# EAGLE design invader_asyn_bridge (EAGLE 7.5.0)
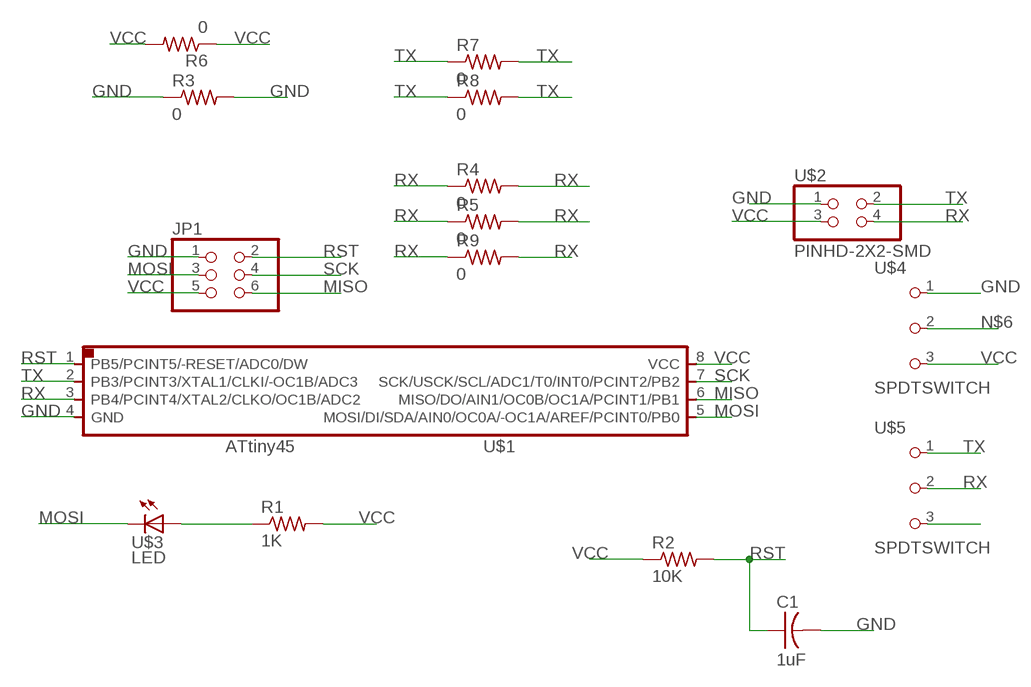
[diagram p0: schematic, sheet 1]

## Parts
C1  1uF  CAP-US1206FAB  [C1206FAB]
JP1  PINHD-2X3-SMD  [2X03SMD]
R1  1K  RES-US1206  [R1206]
R2  10K  RES-US1206  [R1206]
R3  0  RES-US1206  [R1206]
R4  0  RES-US1206  [R1206]
R5  0  RES-US1206  [R1206]
R6  0  RES-US1206  [R1206]
R7  0  RES-US1206  [R1206]
R8  0  RES-US1206  [R1206]
R9  0  RES-US1206  [R1206]
U$1  ATTINY45SI  [SOIC8]
U$2  PINHD-2X2-SMD  [2X02SMD]
U$3  LED  LEDFAB1206  [LED1206FAB]
U$4  SPDTSWITCH  [SPDTSWITCH]
U$5  SPDTSWITCH  [SPDTSWITCH]

## Nets
GND: C1.2 JP1.1 R3.1 R3.2 U$1.4(GND) U$2.1 U$4.1
MISO: JP1.6 U$1.6(MISO/DO/AIN1/OC0B/OC1A/PCINT1/PB1)
MOSI: JP1.3 U$1.5(MOSI/DI/SDA/AIN0/OC0A/-OC1A/AREF/PCINT0/PB0) U$3.2(C)
N$1: R1.1 U$3.1(A)
N$2: U$5.3
N$6: U$4.2
RST: C1.1 JP1.2 R2.2 U$1.1(PB5/PCINT5/-RESET/ADC0/DW)
RX: R4.1 R4.2 R5.1 R5.2 R9.1 R9.2 U$1.3(PB4/PCINT4/XTAL2/CLKO/OC1B/ADC2) U$2.4 U$5.2
SCK: JP1.4 U$1.7(SCK/USCK/SCL/ADC1/T0/INT0/PCINT2/PB2)
TX: R7.1 R7.2 R8.1 R8.2 U$1.2(PB3/PCINT3/XTAL1/CLKI/-OC1B/ADC3) U$2.2 U$5.1
VCC: JP1.5 R1.2 R2.1 R6.1 R6.2 U$1.8(VCC) U$2.3 U$4.3

## Library data of the parts
C1 = fab (1):CAP-US
JP1 = fab (1):PINHD-2X3-SMD: PIN HEADER
R1-R9 = fab (1):RES-US: Resistor (US Symbol) Variants with postfix FAB are widened to allow the routing of internal traces
U$1 = fab (1):ATTINY45
U$2 = fab (1):PINHD-2X2-SMD
U$3 = fab (1):LED: LED
U$4 U$5 = fab:SPDTSWITCH

## Board
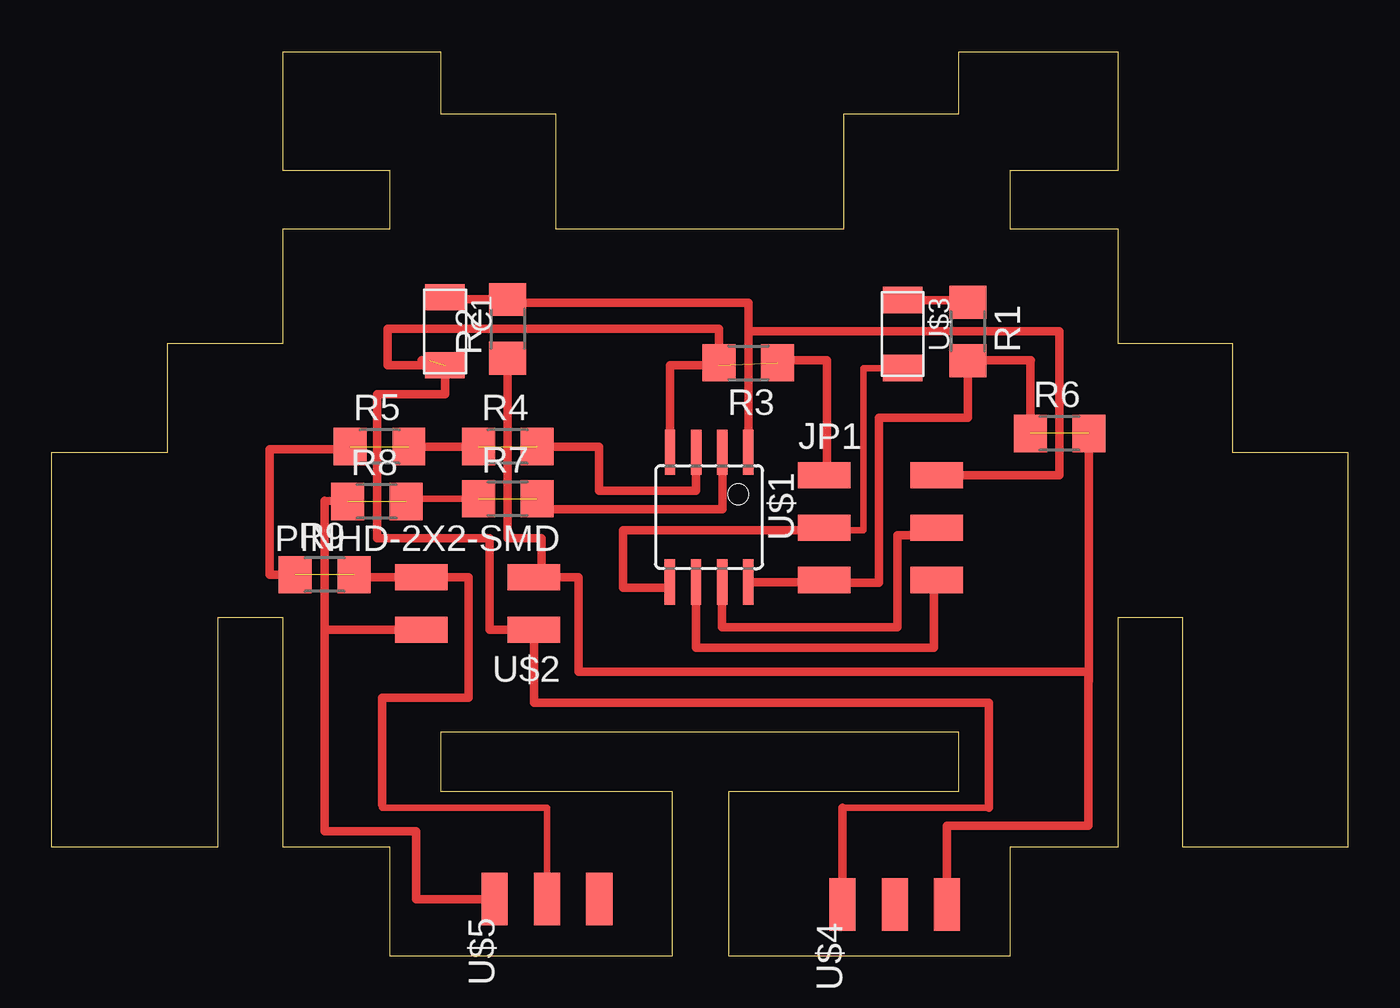
[diagram p1: board, top side]

Size 62.96 x 43.91 mm. Coordinates in mm from the lower left corner, seen from the top.
Outline: 16.45,5.27 11.24,5.27 11.24,16.41 8.06,16.41 8.06,5.27 0,5.27 0,24.45 5.65,24.45 5.65,29.75 11.24,29.75 11.24,35.31 16.45,35.31 16.45,38.13 11.24,38.13 11.24,43.91 18.89,43.91 18.89,40.89 24.48,40.89 24.48,35.31 38.48,35.31 38.48,40.89 44.07,40.89 44.07,43.91 51.78,43.91 51.78,38.13 46.55,38.13 46.55,35.31 51.78,35.31 51.78,29.75 57.34,29.75 57.34,24.45 62.96,24.45 62.96,5.27 54.93,5.27 54.93,16.41 51.78,16.41 51.78,5.27 46.55,5.27 46.55,0 32.89,0 32.89,8 44.07,8 44.07,10.86 18.89,10.86 18.89,8 30.13,8 30.13,0 16.45,0 16.45,5.27
Copper layers (1*16): Top 0.035mm / dielectric 1.5mm / Bottom 0.035mm
Design rules "default *": minimum track width 10mil, minimum drill 24mil, track to track 16mil, track to pad 16mil, pad to pad 16mil, via to via 16mil, smd to smd 16mil, copper to edge 40mil, drill to drill 8mil, minimum pad ring 10mil, minimum via ring 8mil, stop-mask expansion 4mil, vias tented up to drill 0mil, thermal gap 10mil

### Footprints (pad centres in the part's own frame; a part is rotated, then mirrored left to right if it is on the bottom)
C1206FAB = smd 1.27 x 1.905: 1 -1.651,0; 2 1.651,0
2X03SMD = smd 2.54 x 1.27: 1 -2.54,2.54; 2 2.92,2.54; 3 -2.54,0; 4 2.92,0; 5 -2.54,-2.54; 6 2.92,-2.54
R1206 = smd 1.6 x 1.803: 1 -1.422,0; 2 1.422,0
SOIC8 = smd 0.5 x 2.2: 1 -1.905,-3.154; 2 -0.645,-3.154; 3 0.625,-3.154; 4 1.895,-3.154; 5 1.905,3.154; 6 0.635,3.154; 7 -0.635,3.154; 8 -1.905,3.154
2X02SMD = smd 2.54 x 1.27: 1 -2.54,1.27; 2 2.92,1.27; 3 -2.54,-1.27; 4 2.92,-1.27
LED1206FAB = smd 1.27 x 1.905: 1 -1.651,0; 2 1.651,0
SPDTSWITCH = smd 2.54 x 1.27: 1 0.38,2.54; 2 0.38,0; 3 0.38,-2.54

### Placement (x,y rotation side)
C1  19.11,30.32 270 top
JP1  40.06,20.8 0 top
R1  44.51,30.32 270 top
R2  22.15,30.45 90 top
R3  33.84,28.8 180 top
R4  22.15,24.73 0 top
R5  15.93,24.73 0 top
R6  48.95,25.37 0 top
R7  22.15,22.19 0 top
R8  15.8,22.07 0 top
R9  13.26,18.51 0 top
U$1  31.93,21.31 180 top
U$2  20.88,17.11 180 top
U$3  41.33,30.2 270 top
U$4  40.95,2.13 90 top
U$5  24.06,2.38 90 top

### Tracks (layer width: path | path; a pad name or v marks a point on that pad's centre or on a via)
GND  (2 unrouted)
  Top 0.305: 38.41,7.21 45.52,7.21
  Top 0.406: 17.96,28.93 18.34,28.93 | R3.1 35.26,28.93 37.65,28.93 37.65,23.08 JP1.1 | 45.52,7.21 45.52,12.29 23.42,12.29 U$2.1 21.27,15.84 21.27,20.29 15.8,20.29 15.8,27.27 19.11,27.27 C1.2 16.31,28.67 16.31,30.45 32.42,30.45 R3.2 32.42,28.67 30.03,28.67 U$1.4 | 38.41,7.21 U$4.1
MISO
  Top 0.406: JP1.6 42.86,18.26 42.86,14.96 31.3,14.96 U$1.6
MOSI
  Top 0.305: JP1.3 37.65,20.67 39.43,20.67 39.43,28.54 U$3.2
  Top 0.406: JP1.3 37.39,20.67 27.74,20.67 27.74,17.88 30.03,17.88 U$1.5
N$1
  Top 0.406: U$3.1 44.51,31.85 R1.1
RST
  Top 0.406: JP1.2 48.95,23.34 48.95,30.32 33.84,30.32 | 33.84,30.32 33.84,31.72 22.15,31.72 R2.2 19.11,31.87 C1.1 | 33.84,30.32 U$1.1
RX  (4 unrouted)
  Top 0.305: 16.06,7.34 16.06,7.21 24.06,7.21 U$5.2 | U$5.2 24.06,2.26 23.81,2.26 23.81,2.76 U$5.2
  Top 0.406: 16.06,7.34 16.06,12.54 20.25,12.54 20.25,18.38 U$2.4 15.58,18.38 R9.2 | U$1.3 31.31,22.58 26.6,22.58 26.6,24.73 23.55,24.73 | R4.1 R5.2 | R9.1 10.6,18.51 10.6,24.61 14.38,24.61 R5.1
SCK
  Top 0.406: U$1.7 32.57,15.97 41.08,15.97 41.08,20.42 42.73,20.42 JP1.4
TX  (2 unrouted)
  Top 0.305: R8.2 17.35,22.19 R7.1
  Top 0.406: U$5.1 17.71,2.76 17.71,6.07 13.26,6.07 13.26,15.84 | 13.26,15.84 U$2.2 | U$1.2 32.58,21.69 23.58,21.69 R7.2 | R8.1 13.26,22.09 13.26,15.84
VCC  (1 unrouted)
  Top 0.406: U$1.8 37.52,18.15 | 37.52,18.15 JP1.5 | U$4.3 43.49,6.32 50.35,6.32 50.35,13.3 | 50.35,13.3 50.35,13.81 25.58,13.81 25.58,18.38 U$2.3 23.81,18.38 23.81,20.29 22.15,20.29 R2.1 | 37.52,18.15 37.52,18.13 40.19,18.13 40.19,26.13 44.51,26.13 R1.2 44.53,28.93 47.55,28.93 47.53,28.9 R6.1 | R6.2 50.37,13.33 50.35,13.3